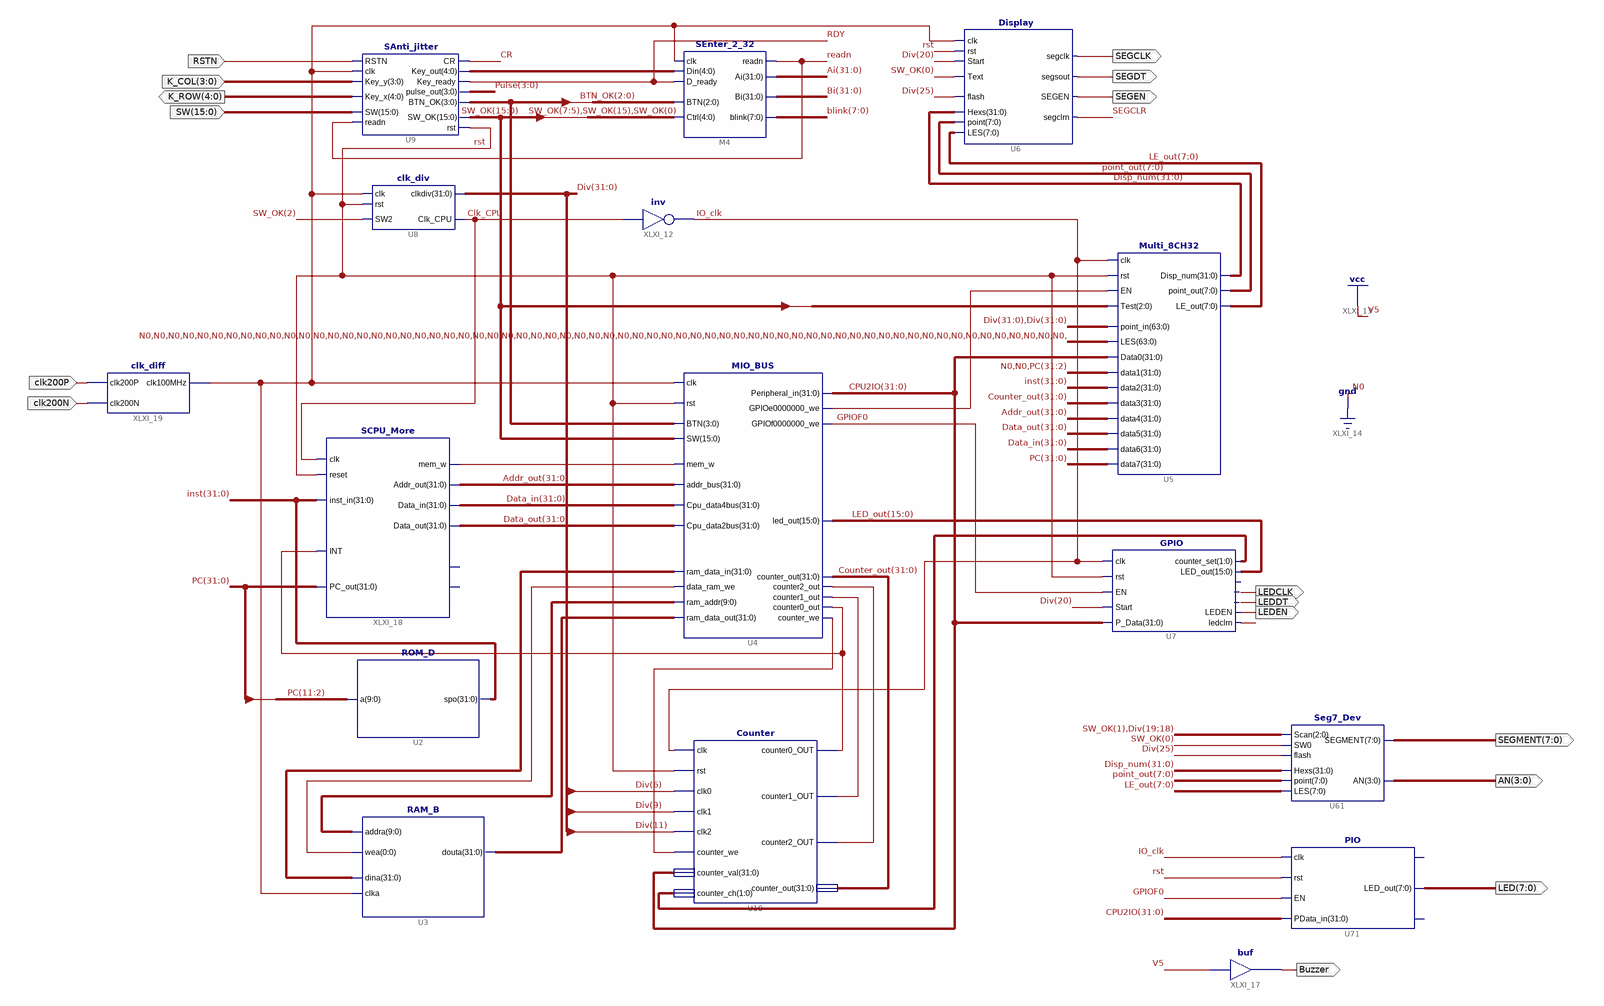
[diagram p0: schematic sheet 1]
// Xilinx ISE schematic OExp07_ExtSCPU.sch (kintex7) as structural Verilog: 16 symbols, 16 ports
module OExp07_ExtSCPU (
  input  RSTN,
  input  [3:0] K_COL,
  input  [15:0] SW,
  input  clk200P,
  input  clk200N,
  output [4:0] K_ROW,
  output SEGCLK,
  output SEGDT,
  output SEGEN,
  output LEDCLK,
  output LEDDT,
  output LEDEN,
  output [7:0] SEGMENT,
  output [3:0] AN,
  output [7:0] LED,
  output Buzzer
);

  wire clk_100mhz, Clk_CPU, count0_OUT, counter1_OUT, counter2_OUT, counter_we, CR, GPIOE0, GPIOF0, IO_clk,
       LEDCLR, mem_w, RDY, readn, rst, SEGCLR, wea;
  wire [1:0] counter_ch;
  wire [3:0] BTN_OK, Pulse;
  wire [4:0] Key_out;
  wire [7:0] blink, LE_out, point_out;
  wire [9:0] addra;
  wire [15:0] LED_out, SW_OK;
  wire [31:0] Addr_out, Ai, Bi, Counter_out, CPU2IO, Data_in, Data_out, dina, Disp_num, Div, douta, inst, PC;

  buf XLXI_17 (Buzzer, 1'b1);
  RAM_B U3 (.addra(addra), .clka(clk_100mhz), .wea(wea), .dina(dina), .douta(douta));
  Counter U10 (
    .clk(IO_clk), .rst(rst), .clk0(Div[6]), .clk1(Div[9]), .clk2(Div[11]), .counter_we(counter_we),
    .counter_val(CPU2IO), .counter_ch(counter_ch), .counter0_OUT(count0_OUT), .counter1_OUT(counter1_OUT),
    .counter2_OUT(counter2_OUT), .counter_out(Counter_out));
  MIO_BUS U4 (
    .rst(rst), .clk(clk_100mhz), .mem_w(mem_w), .addr_bus(Addr_out), .Cpu_data4bus(Data_in),
    .Cpu_data2bus(Data_out), .ram_data_out(douta), .ram_addr(addra), .data_ram_we(wea), .ram_data_in(dina),
    .counter_out(Counter_out), .counter2_out(counter2_OUT), .counter1_out(counter1_OUT),
    .counter0_out(count0_OUT), .counter_we(counter_we), .BTN(BTN_OK), .SW(SW_OK), .led_out(LED_out),
    .Peripheral_in(CPU2IO), .GPIOe0000000_we(GPIOE0), .GPIOf0000000_we(GPIOF0));
  SAnti_jitter U9 (
    .SW(SW), .readn(readn), .Key_y(K_COL), .Key_x(K_ROW), .RSTN(RSTN), .clk(clk_100mhz), .Key_out(Key_out),
    .Key_ready(RDY), .CR(CR), .rst(rst), .SW_OK(SW_OK), .pulse_out(Pulse), .BTN_OK(BTN_OK));
  SEnter_2_32 M4 (
    .readn(readn), .Ai(Ai), .Bi(Bi), .blink(blink), .Din(Key_out), .D_ready(RDY), .clk(clk_100mhz),
    .Ctrl({SW_OK[7:5], SW_OK[15], SW_OK[0]}), .BTN(BTN_OK[2:0]));
  clk_div U8 (.rst(rst), .clk(clk_100mhz), .SW2(SW_OK[2]), .clkdiv(Div), .Clk_CPU(Clk_CPU));
  ROM_D U2 (.a(PC[11:2]), .spo(inst));
  Multi_8CH32 U5 (
    .Test(SW_OK[7:5]), .point_in({Div, Div}), .EN(GPIOE0), .clk(IO_clk), .rst(rst), .LES({64{1'b0}}),
    .Data0(CPU2IO), .data1({2'b00, PC[31:2]}), .data2(inst), .data3(Counter_out), .data4(Addr_out),
    .data5(Data_out), .data6(Data_in), .data7(PC), .point_out(point_out), .LE_out(LE_out), .Disp_num(Disp_num));
  GPIO U7 (
    .clk(IO_clk), .P_Data(CPU2IO), .rst(rst), .EN(GPIOF0), .Start(Div[20]), .ledclk(LEDCLK),
    .LED_out(LED_out), .counter_set(counter_ch), .ledclrn(LEDCLR), .LEDEN(LEDEN), .ledsout(LEDDT));  // open: GPIOf0
  not XLXI_12 (IO_clk, Clk_CPU);
  Display U6 (
    .LES(LE_out), .SEGEN(SEGEN), .segsout(SEGDT), .segclrn(SEGCLR), .point(point_out), .Hexs(Disp_num),
    .Text(SW_OK[0]), .flash(Div[25]), .segclk(SEGCLK), .clk(clk_100mhz), .rst(rst), .Start(Div[20]));
  Seg7_Dev U61 (
    .LES(LE_out), .Scan({SW_OK[1], Div[19:18]}), .SEGMENT(SEGMENT), .AN(AN), .point(point_out),
    .flash(Div[25]), .SW0(SW_OK[0]), .Hexs(Disp_num));
  PIO U71 (.clk(IO_clk), .rst(rst), .EN(GPIOF0), .PData_in(CPU2IO), .LED_out(LED));  // open: GPIOf0, counter_set
  SCPU_More XLXI_18 (
    .clk(Clk_CPU), .reset(rst), .inst_in(inst), .INT(count0_OUT), .Addr_out(Addr_out), .mem_w(mem_w),
    .Data_out(Data_out), .Data_in(Data_in), .PC_out(PC));  // open: CPU_MIO, MIO_ready
  clk_diff XLXI_19 (.clk200P(clk200P), .clk200N(clk200N), .clk100MHz(clk_100mhz));
endmodule
